# Altium schematic sheet Remote.SchDoc
size A4
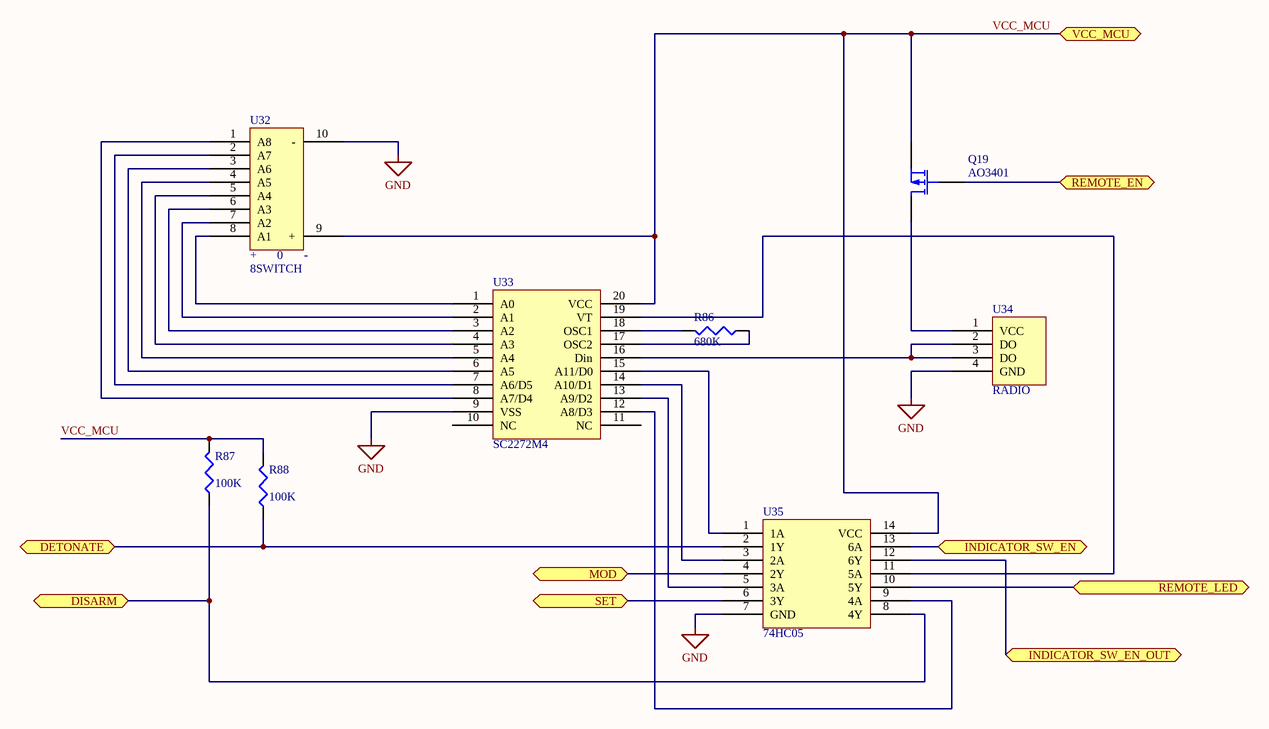
[diagram p0: Remote.SchDoc]

## Parts
Q19  AO3401  [SOT23-3-PMOS]
R86  value 680K  [0603]  (hidden comment: Res3)
R87  value 100K  [0603]  (hidden comment: Res3)
R88  value 100K  [0603]  (hidden comment: Res3)
U32  8SWITCH  [DSDT08LSGET]
U33  SC2272M4  [WSO20_M]
U34  RADIO  [RADIO]
U35  74HC05  [TSSOP14]

## Ports
DETONATE (bidir), DISARM (bidir), INDICATOR_SW_EN (bidir), INDICATOR_SW_EN_OUT (bidir), MOD (bidir), REMOTE_EN (bidir), REMOTE_LED (bidir), SET (bidir), VCC_MCU (bidir)

## Nets
GND: U32.10(-) U33.9(VSS) U34.4(GND) U35.7(GND)
DETONATE: R88.1 U35.2(1Y) ; port DETONATE
DISARM: R87.1 U35.8(4Y) ; port DISARM
INDICATOR_SW_EN: U35.13(6A) ; port INDICATOR_SW_EN
INDICATOR_SW_EN_OUT: U35.12(6Y) ; port INDICATOR_SW_EN_OUT
MOD: U35.4(2Y) ; port MOD
REMOTE_EN: Q19.2(G) ; port REMOTE_EN
REMOTE_LED: U35.10(5Y) ; port REMOTE_LED
SET: U35.6(3Y) ; port SET
VCC_MCU: Q19.3(S) R87.2 R88.2 U32.9(+) U33.20(VCC) U35.14(VCC) ; port VCC_MCU
NetQ19_1: Q19.1(D) U34.1(VCC)
NetR86_1: R86.1 U33.17(OSC2)
NetR86_2: R86.2 U33.18(OSC1)
NetU32_1: U32.1(A8) U33.8(A7/D4)
NetU32_2: U32.2(A7) U33.7(A6/D5)
NetU32_3: U32.3(A6) U33.6(A5)
NetU32_4: U32.4(A5) U33.5(A4)
NetU32_5: U32.5(A4) U33.4(A3)
NetU32_6: U32.6(A3) U33.3(A2)
NetU32_7: U32.7(A2) U33.2(A1)
NetU32_8: U32.8(A1) U33.1(A0)
NetU33_12: U33.12(A8/D3) U35.9(4A)
NetU33_13: U33.13(A9/D2) U35.5(3A)
NetU33_14: U33.14(A10/D1) U35.3(2A)
NetU33_15: U33.15(A11/D0) U35.1(1A)
NetU33_16: U33.16(Din) U34.2(DO) U34.3(DO)
NetU33_19: U33.19(VT) U35.11(5A)

Not connected (* = marked no-connect by the designer): U33 10(NC) 11(NC)

## Notes on the sheet
- (in symbol 8SWITCH) 0

## Library data of the parts
Q19 = MOSFET-P: P-Channel MOSFET; Published: 8-Jun-2000; LatestRevisionDate: 17-Jul-2002; LatestRevisionNote: Re-released for DXP Platform.; PackageVersion: 1995/1996; PackageReference: E3; Publisher: Altium Limited; PackageDescription: TO, Flat Index; 3 In-Line, Axial Leads; Body Dia. 4.6mm; Lead Dia. 0.5 mm (max)
R86-R88 = Res3: Resistor; Published: 8-Jun-2000; LatestRevisionDate: 29-May-2009; LatestRevisionNote: IPC-7351 Footprint Added.; PackageReference: J1-0603; Publisher: Altium Limited; PackageDescription: Chip Resistor